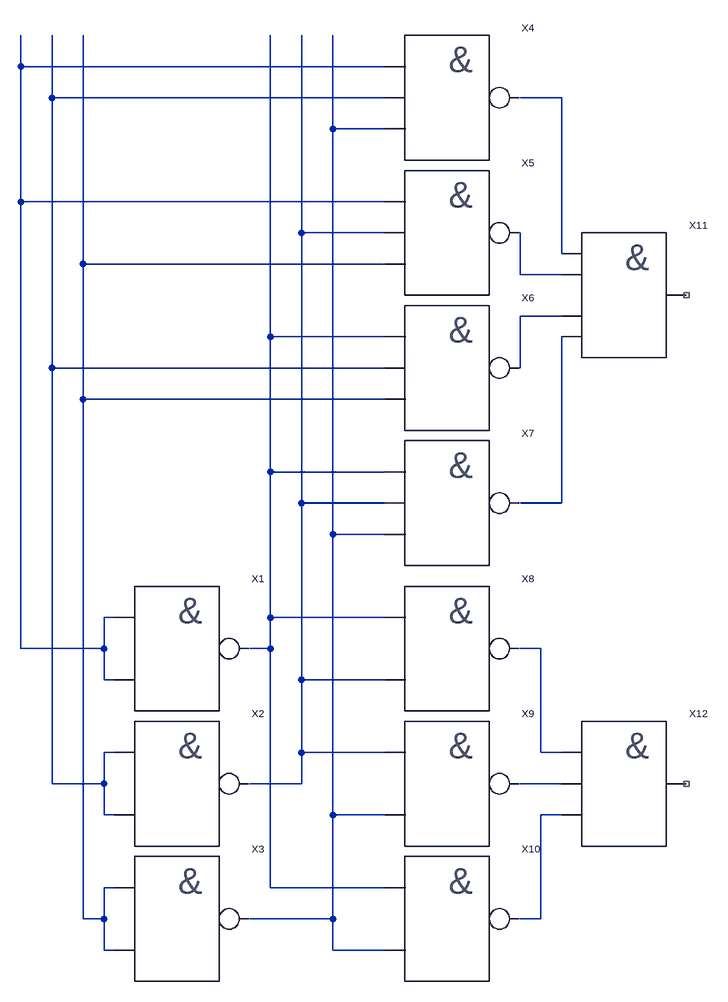
[diagram p0: schematic odnDvSum.asc]
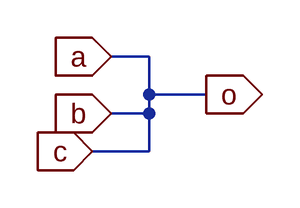
[diagram p1: sub-circuit and3.asc]
odnDvSum.asc, the LTspice schematic file:
Version 4
SHEET 1 1032 2164
WIRE -16 752 -16 704
WIRE 544 752 -16 752
WIRE 32 800 32 704
WIRE 544 800 32 800
WIRE 816 800 752 800
WIRE 464 848 464 704
WIRE 544 848 464 848
WIRE -16 960 -16 752
WIRE 544 960 -16 960
WIRE 416 1008 416 704
WIRE 544 1008 416 1008
WIRE 816 1040 816 800
WIRE 80 1056 80 704
WIRE 544 1056 80 1056
WIRE 752 1072 752 1008
WIRE 816 1072 752 1072
WIRE 816 1136 752 1136
WIRE 368 1168 368 704
WIRE 544 1168 368 1168
WIRE 32 1216 32 800
WIRE 544 1216 32 1216
WIRE 752 1216 752 1136
WIRE 80 1264 80 1056
WIRE 544 1264 80 1264
WIRE 368 1376 368 1168
WIRE 544 1376 368 1376
WIRE 416 1424 416 1008
WIRE 544 1424 416 1424
WIRE 816 1424 816 1168
WIRE 816 1424 752 1424
WIRE 464 1472 464 848
WIRE 544 1472 464 1472
WIRE 128 1600 112 1600
WIRE 368 1600 368 1376
WIRE 544 1600 368 1600
WIRE -16 1648 -16 960
WIRE 112 1648 112 1600
WIRE 112 1648 -16 1648
WIRE 368 1648 368 1600
WIRE 368 1648 336 1648
WIRE 784 1648 752 1648
WIRE 112 1696 112 1648
WIRE 128 1696 112 1696
WIRE 416 1696 416 1424
WIRE 544 1696 416 1696
WIRE 128 1808 112 1808
WIRE 416 1808 416 1696
WIRE 544 1808 416 1808
WIRE 784 1808 784 1648
WIRE 816 1808 784 1808
WIRE 32 1856 32 1216
WIRE 112 1856 112 1808
WIRE 112 1856 32 1856
WIRE 416 1856 416 1808
WIRE 416 1856 336 1856
WIRE 816 1856 752 1856
WIRE 112 1904 112 1856
WIRE 128 1904 112 1904
WIRE 464 1904 464 1472
WIRE 544 1904 464 1904
WIRE 816 1904 784 1904
WIRE 128 2016 112 2016
WIRE 368 2016 368 1648
WIRE 544 2016 368 2016
WIRE 80 2064 80 1264
WIRE 112 2064 112 2016
WIRE 112 2064 80 2064
WIRE 464 2064 464 1904
WIRE 464 2064 336 2064
WIRE 784 2064 784 1904
WIRE 784 2064 752 2064
WIRE 112 2112 112 2064
WIRE 128 2112 112 2112
WIRE 464 2112 464 2064
WIRE 544 2112 464 2112
SYMBOL NAND2 224 1648 R0
SYMATTR InstName X1
SYMBOL NAND2 224 1856 R0
SYMATTR InstName X2
SYMBOL NAND2 224 2064 R0
SYMATTR InstName X3
SYMBOL NAND3 640 800 R0
SYMATTR InstName X4
SYMBOL NAND3 640 1008 R0
SYMATTR InstName X5
SYMBOL NAND3 640 1216 R0
SYMATTR InstName X6
SYMBOL NAND3 640 1424 R0
SYMATTR InstName X7
SYMBOL NAND2 640 1648 R0
SYMATTR InstName X8
SYMBOL NAND2 640 1856 R0
SYMATTR InstName X9
SYMBOL NAND2 640 2064 R0
SYMATTR InstName X10
SYMBOL AND4 912 1104 R0
SYMATTR InstName X11
SYMBOL AND3 912 1856 R0
SYMATTR InstName X12

and3.asc, the sub-circuit schematic file:
Version 4
SHEET 1 880 680
WIRE 96 80 64 80
WIRE 96 112 96 80
WIRE 144 112 96 112
WIRE 96 128 96 112
WIRE 96 128 64 128
WIRE 96 160 96 128
WIRE 96 160 48 160
FLAG 64 80 a
IOPIN 64 80 In
FLAG 64 128 b
IOPIN 64 128 In
FLAG 144 112 o
IOPIN 144 112 Out
FLAG 48 160 c
IOPIN 48 160 In

The netlist it stands for:
* odnDvSum.asc
XX1 N001 N001 N009 NAND2  ; pins a b o
XX2 N002 N002 N005 NAND2  ; pins a b o
XX3 N006 N006 N004 NAND2  ; pins a b o
XX4 N001 N004 N003 N002 NAND3  ; pins a b o c
XX5 N001 N006 N007 N005 NAND3  ; pins a b o c
XX6 N009 N006 N008 N002 NAND3  ; pins a b o c
XX7 N009 N004 N010 N005 NAND3  ; pins a b o c
XX8 N009 N005 N011 NAND2  ; pins a b o
XX9 N005 N004 N012 NAND2  ; pins a b o
XX10 N009 N004 N013 NAND2  ; pins a b o
XX11 N003 N010 NC_01 N007 N008 AND4  ; pins a b o c d
XX12 N011 N013 NC_02 N012 and3

* block symbol definitions
.subckt and3 a b o c
.ends and3

.backanno
.end